# EAGLE board Olympus v1 (EAGLE 7.2.0)
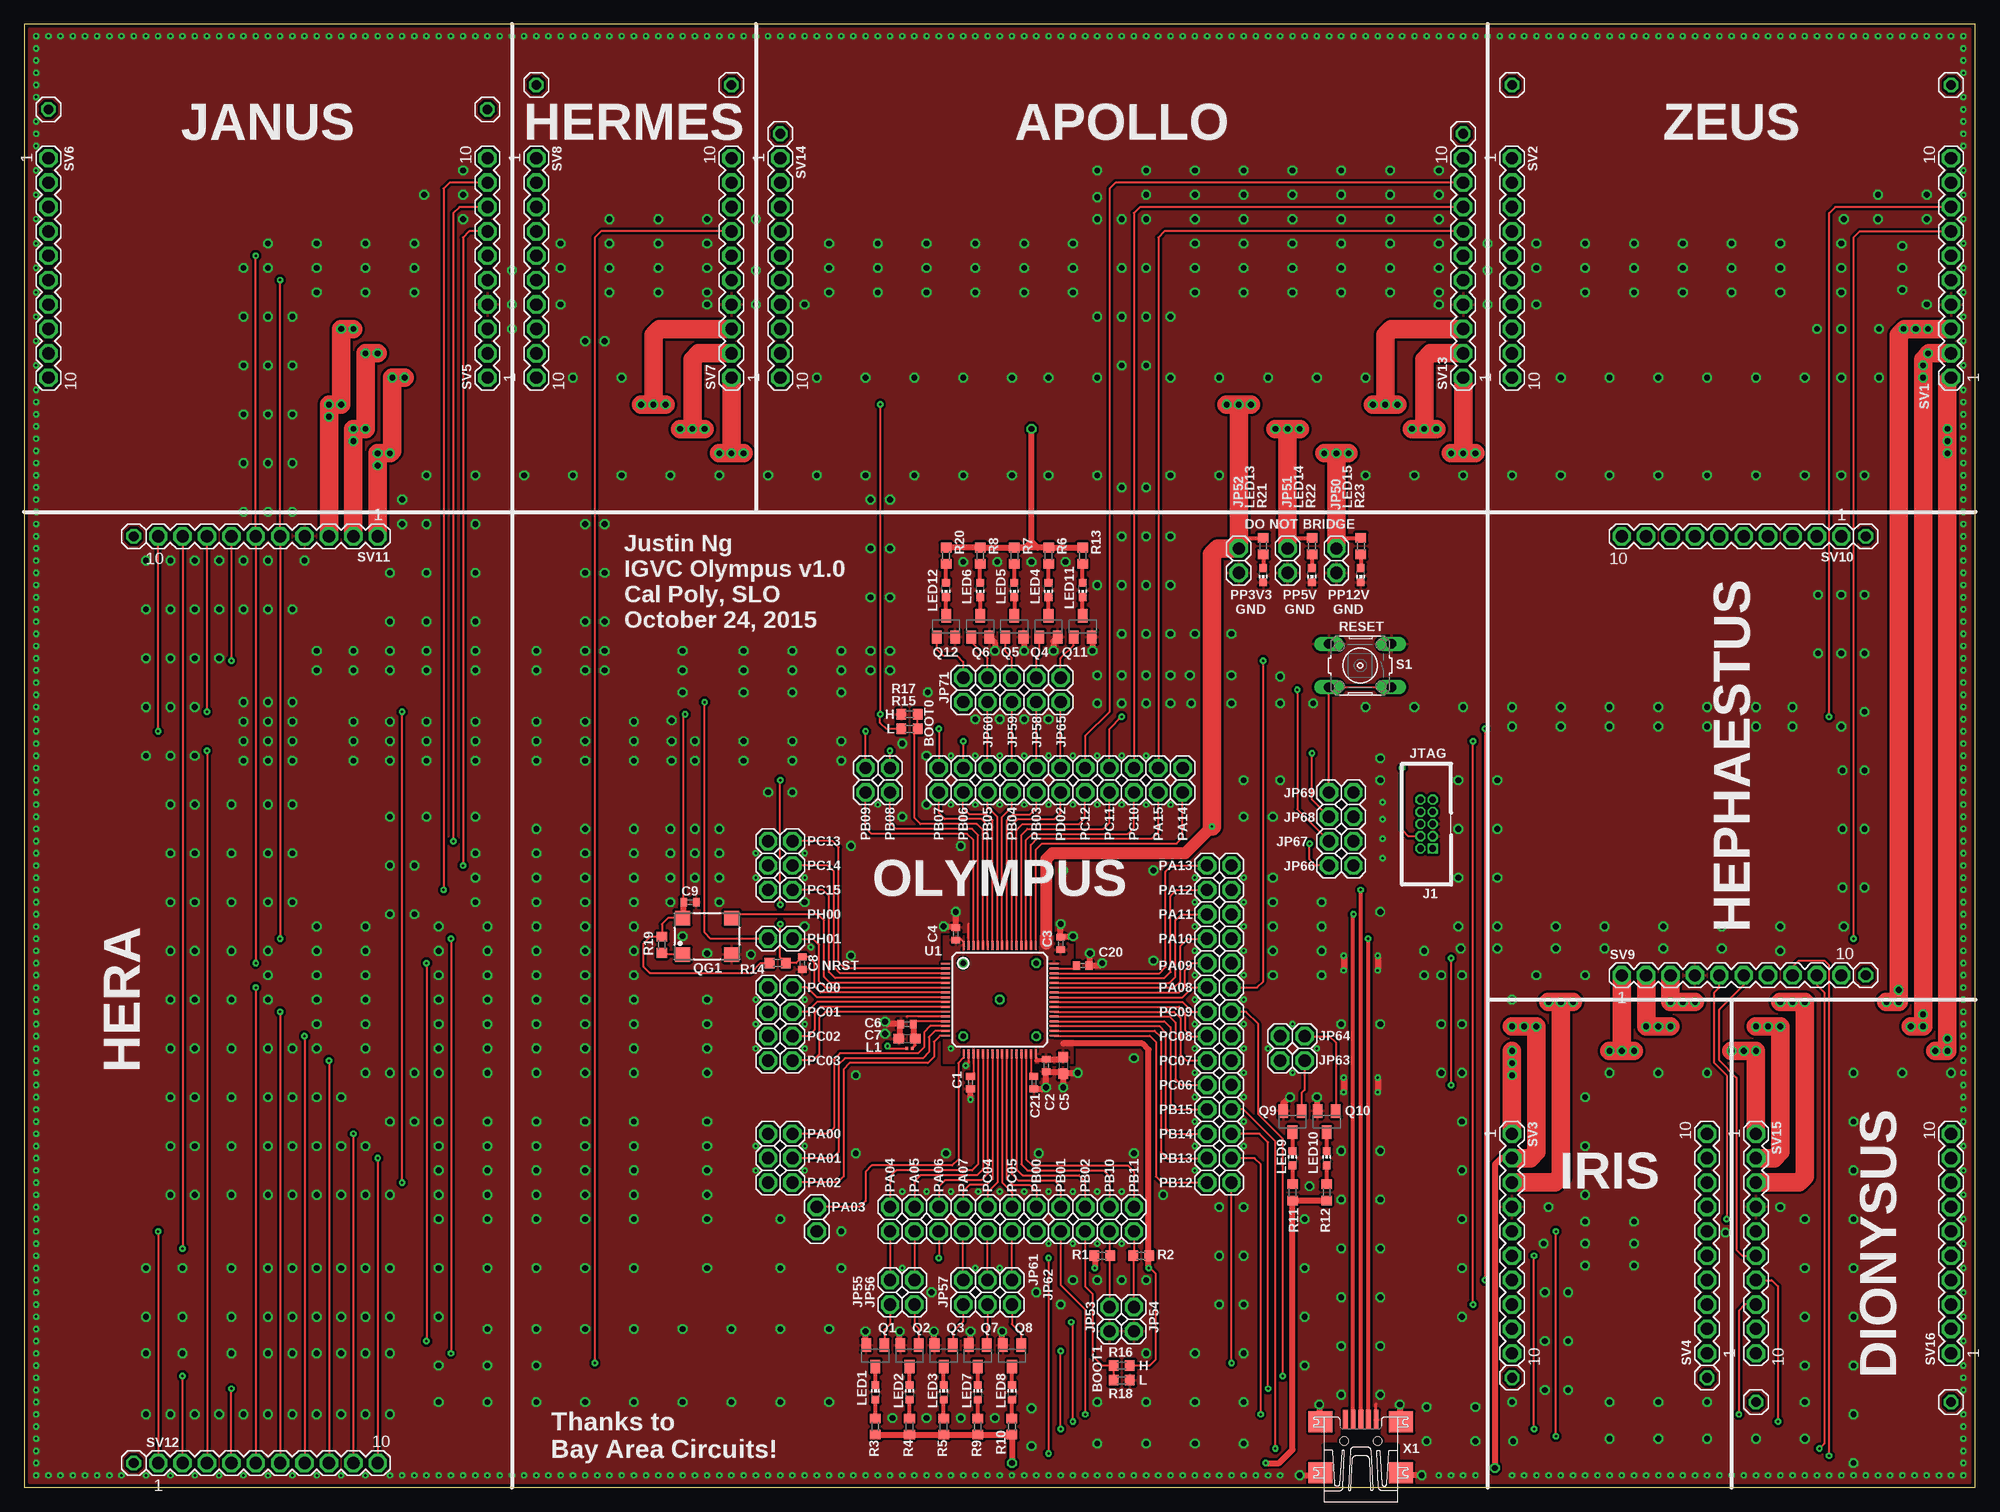
[diagram p2: board, top side]
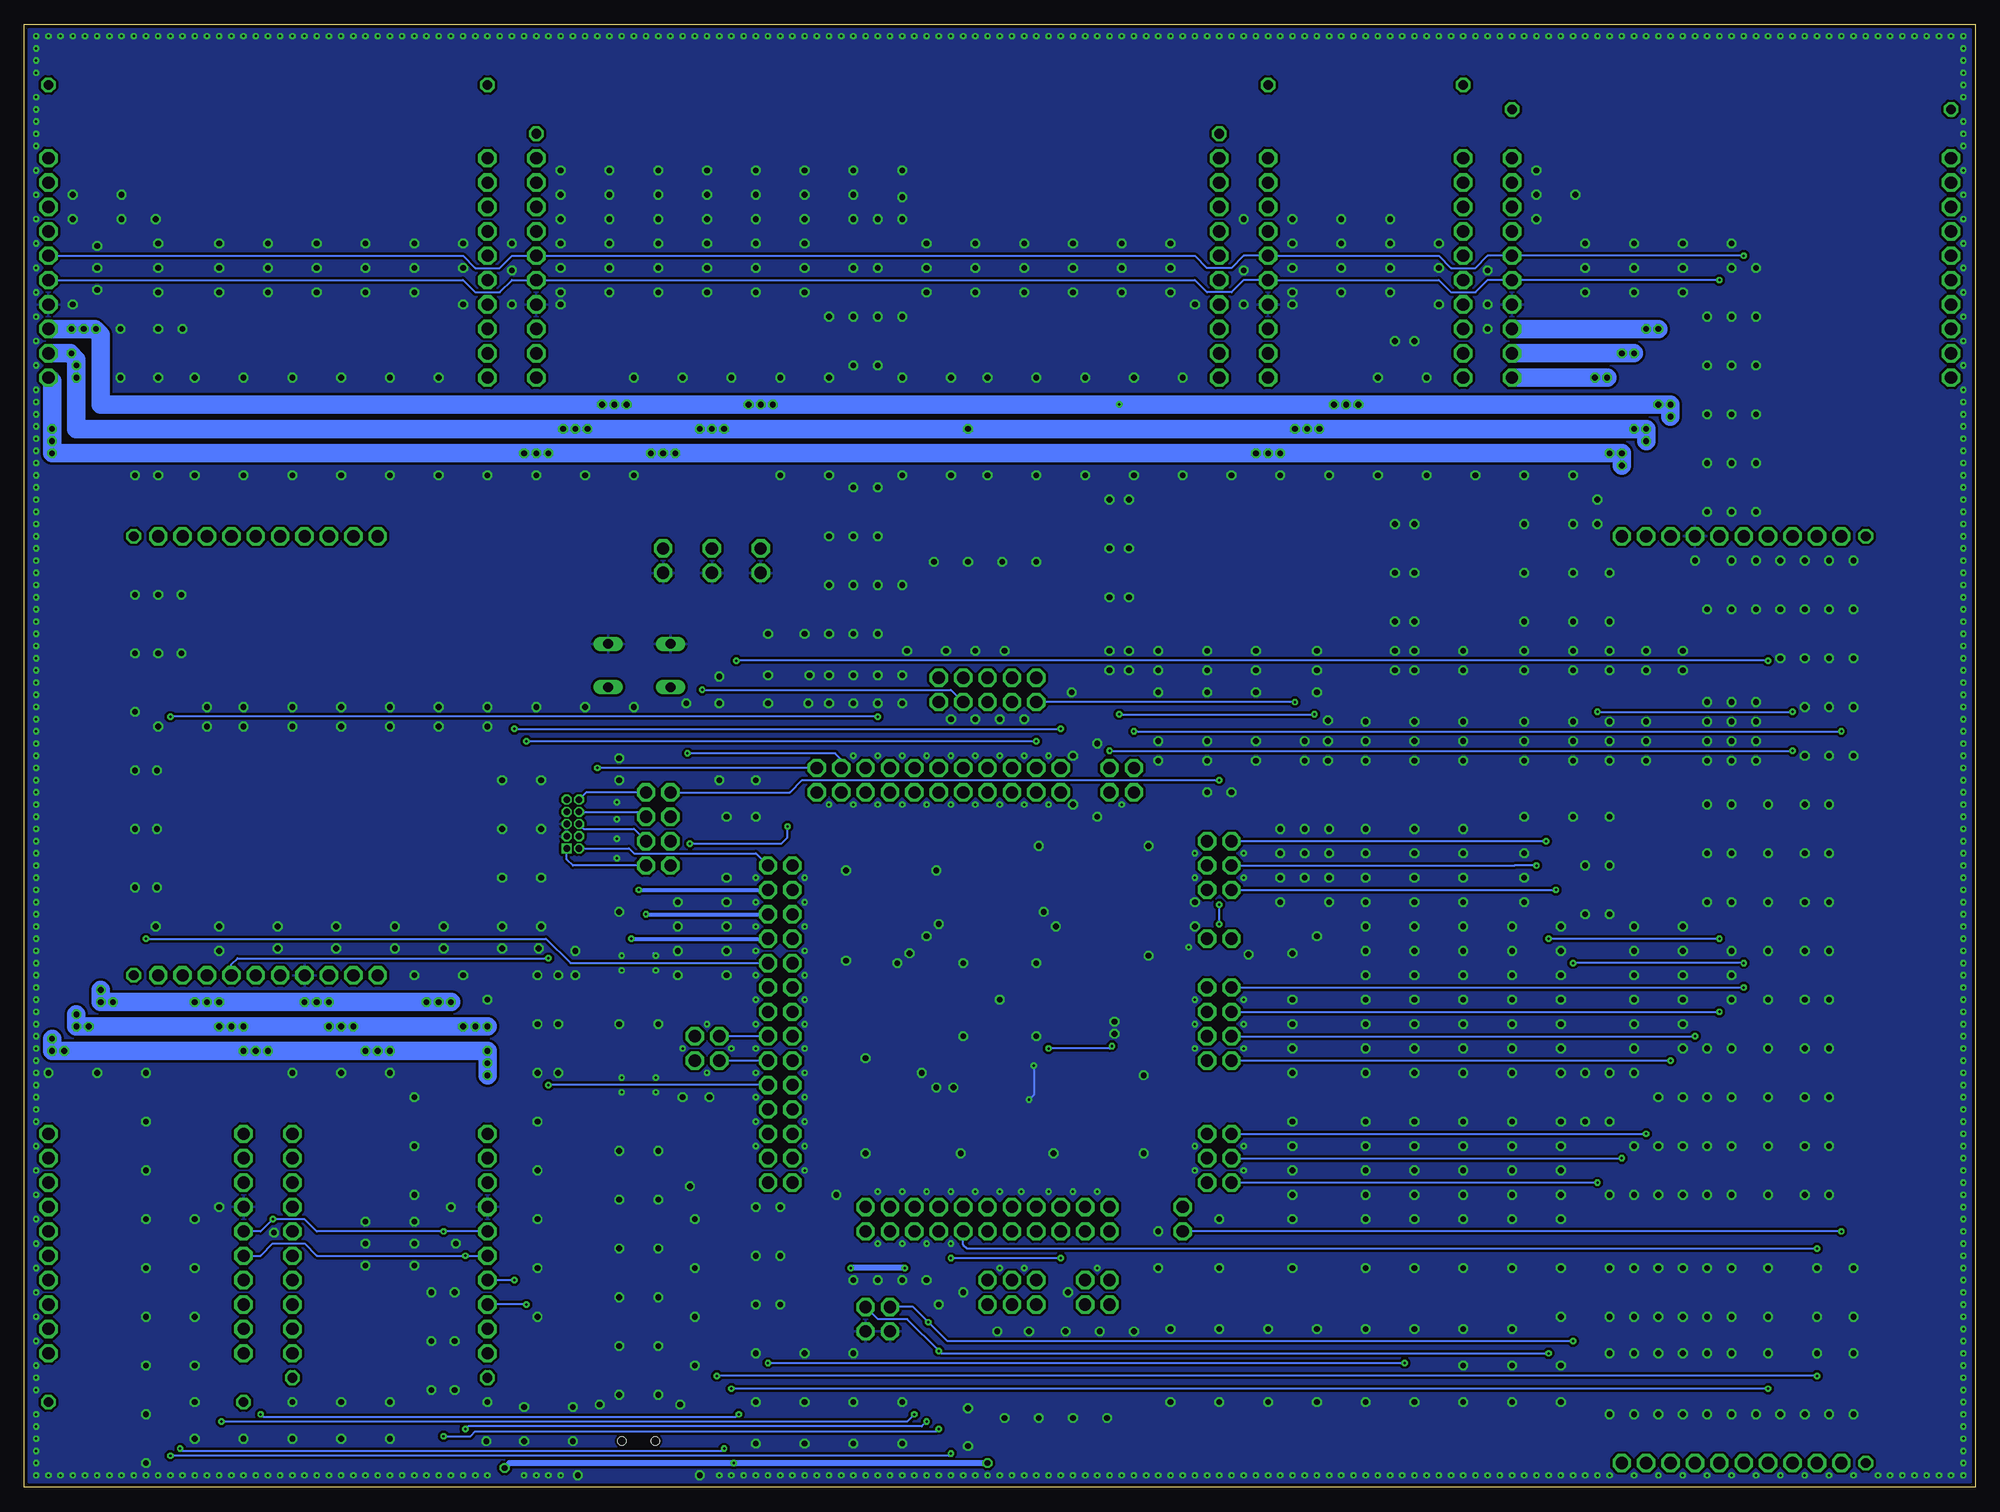
[diagram p3: board, bottom side, seen from below]

Size 203.2 x 152.4 mm. Coordinates in mm from the lower left corner, seen from the top.
Outline: 0,0 203.2,0 203.2,152.4 0,152.4 0,0
Copper layers (1*16): Top 0.035mm / dielectric 1.5mm / Bottom 0.035mm
Design rules "default *": minimum track width 7mil, minimum drill 10mil, track to track 8mil, track to pad 8mil, pad to pad 8mil, via to via 8mil, smd to smd 8mil, copper to edge 10mil, drill to drill 8mil, minimum pad ring 0mil, minimum via ring 8mil, stop-mask expansion 4mil, vias tented up to drill 0mil, thermal gap 10mil

## Footprints (pad centres in the part's own frame; a part is rotated, then mirrored left to right if it is on the bottom)
C0402 = smd 0.7 x 0.9: 1 -0.65,0; 2 0.65,0
C0603 = smd 1.1 x 1: 1 -0.85,0; 2 0.85,0
HEADER_10P_0.05 = drill 0.7 pad 1.016 square: 1 -2.54,-0.635 | drill 0.7 pad 1.016 octagon: 2 -2.54,0.635; 3 -1.27,-0.635; 4 -1.27,0.635; 5 0,-0.635; 6 0,0.635; 7 1.27,-0.635; 8 1.27,0.635; 9 2.54,-0.635; 10 2.54,0.635
1X02 = drill 1.27 octagon: 1 -1.27,0; 2 1.27,0
1X01 = drill 1.016 octagon: 1 0,0
L0201 = smd 0.25 x 0.35: 1 -0.275,0; 2 0.275,0
CHIP-LED0603 = smd 0.8 x 0.8: A 0,-0.75; C 0,0.75
SOT23 = smd 1 x 1.4: 1 -0.95,-1.1; 2 0.95,-1.1; 3 0,1.1
SM77H = smd 1.6 x 1.5: 1 -2.55,-1.9; 2 2.55,-1.9; 3 2.55,1.9; 4 -2.55,1.9
R0603 = smd 1 x 1.1: 1 -0.85,0; 2 0.85,0
B3F-10XX = drill 1.016 long: 1 -3.251,2.261; 2 3.251,2.261; 3 -3.251,-2.261; 4 3.251,-2.261
MA10-1 = drill 1.27 octagon: 1 -11.43,0; 2 -8.89,0; 3 -6.35,0; 4 -3.81,0; 5 -1.27,0; 6 1.27,0; 7 3.81,0; 8 6.35,0; 9 8.89,0; 10 11.43,0
LQFP-ST-64-2 = smd 0.9 x 0.2: 1 -5.65,3.75; 2 -5.65,3.25; 3 -5.65,2.75; 4 -5.65,2.25; 5 -5.65,1.75; 6 -5.65,1.25; 7 -5.65,0.75; 8 -5.65,0.25; 9 -5.65,-0.25; 10 -5.65,-0.75; 11 -5.65,-1.25; 12 -5.65,-1.75; 13 -5.65,-2.25; 14 -5.65,-2.75; 15 -5.65,-3.25; 16 -5.65,-3.75; 33 5.65,-3.75; 34 5.65,-3.25; 35 5.65,-2.75; 36 5.65,-2.25; 37 5.65,-1.75; 38 5.65,-1.25; 39 5.65,-0.75; 40 5.65,-0.25; 41 5.65,0.25; 42 5.65,0.75; 43 5.65,1.25; 44 5.65,1.75; 45 5.65,2.25; 46 5.65,2.75; 47 5.65,3.25; 48 5.65,3.75 | smd 0.2 x 0.9: 17 -3.75,-5.65; 18 -3.25,-5.65; 19 -2.75,-5.65; 20 -2.25,-5.65; 21 -1.75,-5.65; 22 -1.25,-5.65; 23 -0.75,-5.65; 24 -0.25,-5.65; 25 0.25,-5.65; 26 0.75,-5.65; 27 1.25,-5.65; 28 1.75,-5.65; 29 2.25,-5.65; 30 2.75,-5.65; 31 3.25,-5.65; 32 3.75,-5.65; 49 3.75,5.65; 50 3.25,5.65; 51 2.75,5.65; 52 2.25,5.65; 53 1.75,5.65; 54 1.25,5.65; 55 0.75,5.65; 56 0.25,5.65; 57 -0.25,5.65; 58 -0.75,5.65; 59 -1.25,5.65; 60 -1.75,5.65; 61 -2.25,5.65; 62 -2.75,5.65; 63 -3.25,5.65; 64 -3.75,5.65
UX60-MB-5ST = smd 2 x 0.5: 1 2.25,1.6; 2 2.25,0.8; 3 2.25,0; 4 2.25,-0.8; 5 2.25,-1.6 | smd 2.2 x 2.5: M1 -3.3,-4.2; M2 -3.3,4.2; M3 2,4.2; M4 2,-4.2 | hole 0.9: 0,-1.75; 0,1.75

## Placement (x,y rotation side)
C1  0.1uF  [C0402]  98.55,42.16 270 top
C2  0.1uF  [C0402]  106.43,43.94 270 top
C3  0.1uF  [C0402]  107.95,56.64 90 top
C4  0.1uF  [C0402]  97.03,57.66 90 top
C5  4.7uF  [C0603]  108.2,43.94 270 top
C6  0.1uF  [C0402]  91.95,48.26 180 top
C7  1uF  [C0603]  91.95,46.74 180 top
C8  0.1uF  [C0402]  81.03,54.61 270 top
C9  0.1uF  [C0402]  69.34,60.96 0 top
C20  2.2uF  [C0402]  110.24,54.36 0 top
C21  2.2uF  [C0402]  105.16,42.16 270 top
J1  HEADER_10P_0.05  [HEADER_10P_0.05]  146.05,69.09 90 top
JP1  [1X02]  78.74,36.83 0 top
JP2  [1X02]  78.74,34.29 0 top
JP3  [1X02]  78.74,31.75 0 top
JP4  [1X02]  82.55,27.94 90 top
JP5  [1X02]  90.17,27.94 90 top
JP6  [1X02]  92.71,27.94 90 top
JP7  [1X02]  95.25,27.94 90 top
JP8  [1X02]  97.79,27.94 90 top
JP9  [1X02]  124.46,52.07 180 top
JP10  [1X02]  124.46,54.61 180 top
JP11  [1X02]  124.46,57.15 180 top
JP12  [1X02]  124.46,59.69 180 top
JP13  [1X02]  124.46,62.23 180 top
JP14  [1X02]  124.46,64.77 180 top
JP15  [1X02]  120.65,73.66 270 top
JP16  [1X02]  118.11,73.66 270 top
JP17  [1X02]  105.41,27.94 90 top
JP18  [1X02]  107.95,27.94 90 top
JP19  [1X02]  110.49,27.94 90 top
JP20  [1X02]  105.41,73.66 270 top
JP21  [1X02]  102.87,73.66 270 top
JP22  [1X02]  100.33,73.66 270 top
JP23  [1X02]  97.79,73.66 270 top
JP24  [1X02]  95.25,73.66 270 top
JP25  [1X02]  90.17,73.66 270 top
JP26  [1X02]  87.63,73.66 270 top
JP27  [1X02]  113.03,27.94 90 top
JP28  [1X02]  115.57,27.94 90 top
JP29  [1X02]  124.46,31.75 180 top
JP30  [1X02]  124.46,34.29 180 top
JP31  [1X02]  124.46,36.83 180 top
JP32  [1X02]  124.46,39.37 180 top
JP33  [1X02]  78.74,52.07 180 top
JP34  [1X02]  78.74,49.53 180 top
JP35  [1X02]  78.74,46.99 180 top
JP36  [1X02]  78.74,44.45 180 top
JP37  [1X02]  100.33,27.94 270 top
JP38  [1X02]  102.87,27.94 270 top
JP39  [1X02]  124.46,41.91 0 top
JP40  [1X02]  124.46,44.45 0 top
JP41  [1X02]  124.46,46.99 0 top
JP42  [1X02]  124.46,49.53 0 top
JP43  [1X02]  115.57,73.66 90 top
JP44  [1X02]  113.03,73.66 90 top
JP45  [1X02]  110.49,73.66 90 top
JP46  [1X02]  78.74,67.31 180 top
JP47  [1X02]  78.74,64.77 180 top
JP48  [1X02]  78.74,62.23 180 top
JP49  [1X02]  107.95,73.66 90 top
JP50  [1X02]  136.65,96.52 270 top
JP51  [1X02]  131.57,96.52 270 top
JP52  [1X02]  126.49,96.52 270 top
JP53  [1X02]  113.03,17.53 270 top
JP54  [1X02]  115.57,17.53 270 top
JP55  [1X02]  90.17,20.32 90 top
JP56  [1X02]  92.71,20.32 90 top
JP57  [1X02]  97.79,20.32 90 top
JP58  [1X02]  105.41,83.06 270 top
JP59  [1X02]  102.87,83.06 270 top
JP60  [1X02]  100.33,83.06 270 top
JP61  [1X02]  100.33,20.32 90 top
JP62  [1X02]  102.87,20.32 90 top
JP63  [1X02]  132.08,44.45 180 top
JP64  [1X02]  132.08,46.99 180 top
JP65  [1X02]  107.95,83.06 270 top
JP66  [1X02]  137.16,64.77 0 top
JP67  [1X02]  137.16,67.31 180 top
JP68  [1X02]  137.16,69.85 180 top
JP69  [1X02]  137.16,72.39 180 top
JP70  [1X02]  78.74,57.15 180 top
JP71  [1X02]  97.79,83.06 270 top
JP72  [1X01]  11.43,2.54 0 top
JP73  [1X01]  11.43,99.06 0 top
JP74  [1X01]  2.54,143.51 0 top
JP75  [1X01]  48.26,143.51 0 top
JP76  [1X01]  53.34,146.05 0 top
JP77  [1X01]  73.66,146.05 0 top
JP78  [1X01]  78.74,140.97 0 top
JP79  [1X01]  149.86,140.97 0 top
JP80  [1X01]  154.94,146.05 0 top
JP81  [1X01]  200.66,146.05 0 top
JP82  [1X01]  191.77,53.34 0 top
JP83  [1X01]  191.77,99.06 0 top
JP84  [1X01]  154.94,11.43 0 top
JP85  [1X01]  175.26,11.43 0 top
JP86  [1X01]  180.34,8.89 0 top
JP87  [1X01]  200.66,8.89 0 top
L1  [L0201]  92.2,45.72 180 top
LED1  [CHIP-LED0603]  88.65,9.91 0 top
LED2  [CHIP-LED0603]  92.2,9.91 0 top
LED3  [CHIP-LED0603]  95.76,9.91 0 top
LED4  [CHIP-LED0603]  106.68,93.47 180 top
LED5  [CHIP-LED0603]  103.12,93.47 180 top
LED6  [CHIP-LED0603]  99.57,93.47 180 top
LED7  [CHIP-LED0603]  99.31,9.91 0 top
LED8  [CHIP-LED0603]  102.87,9.91 0 top
LED9  [CHIP-LED0603]  132.08,34.29 0 top
LED10  [CHIP-LED0603]  135.64,34.29 0 top
LED11  [CHIP-LED0603]  110.24,93.47 180 top
LED12  [CHIP-LED0603]  96.01,93.47 180 top
LED13  [CHIP-LED0603]  129.03,95 180 top
LED14  [CHIP-LED0603]  134.11,95 180 top
LED15  [CHIP-LED0603]  139.19,95 180 top
Q1  BSS138  [SOT23]  88.65,13.72 180 top
Q2  BSS138  [SOT23]  92.2,13.72 180 top
Q3  BSS138  [SOT23]  95.76,13.72 180 top
Q4  BSS138  [SOT23]  106.68,89.66 0 top
Q5  BSS138  [SOT23]  103.12,89.66 0 top
Q6  BSS138  [SOT23]  99.57,89.66 0 top
Q7  BSS138  [SOT23]  99.31,13.72 180 top
Q8  BSS138  [SOT23]  102.87,13.72 180 top
Q9  BSS138  [SOT23]  132.08,38.1 180 top
Q10  BSS138  [SOT23]  135.64,38.1 180 top
Q11  BSS138  [SOT23]  110.24,89.66 0 top
Q12  BSS138  [SOT23]  96.01,89.66 0 top
QG1  KC7050A20.0000C3GE00  [SM77H]  71.12,57.4 0 top
R1  3.3k  [R0603]  112.27,24.13 180 top
R2  3.3k  [R0603]  116.33,24.13 0 top
R3  100  [R0603]  88.65,6.35 270 top
R4  100  [R0603]  92.2,6.35 270 top
R5  100  [R0603]  95.76,6.35 270 top
R6  100  [R0603]  106.68,97.03 90 top
R7  100  [R0603]  103.12,97.03 90 top
R8  100  [R0603]  99.57,97.03 90 top
R9  100  [R0603]  99.31,6.35 270 top
R10  100  [R0603]  102.87,6.35 270 top
R11  100  [R0603]  132.08,30.73 270 top
R12  100  [R0603]  135.64,30.73 270 top
R13  100  [R0603]  110.24,97.03 90 top
R14  10k  [R0603]  78.49,54.61 180 top
R15  10k  [R0603]  92.2,78.99 180 top
R16  10k  [R0603]  114.3,12.7 0 top
R17  10k  [R0603]  92.2,80.52 0 top
R18  10k  [R0603]  114.3,11.18 180 top
R19  10k  [R0603]  66.42,56.52 90 top
R20  100  [R0603]  96.01,97.03 90 top
R21  100  [R0603]  129.03,98.04 90 top
R22  100  [R0603]  134.11,98.04 90 top
R23  100  [R0603]  139.19,98.04 90 top
S1  [B3F-10XX]  139.13,85.6 180 top
SV1  [MA10-1]  200.66,127 90 top
SV2  [MA10-1]  154.94,127 270 top
SV3  [MA10-1]  154.94,25.4 270 top
SV4  [MA10-1]  175.26,25.4 90 top
SV5  [MA10-1]  48.26,127 90 top
SV6  [MA10-1]  2.54,127 270 top
SV7  [MA10-1]  73.66,127 90 top
SV8  [MA10-1]  53.34,127 270 top
SV9  [MA10-1]  177.8,53.34 0 top
SV10  [MA10-1]  177.8,99.06 180 top
SV11  [MA10-1]  25.4,99.06 180 top
SV12  [MA10-1]  25.4,2.54 0 top
SV13  [MA10-1]  149.86,127 90 top
SV14  [MA10-1]  78.74,127 270 top
SV15  [MA10-1]  180.34,25.4 270 top
SV16  [MA10-1]  200.66,25.4 90 top
U1  STM32F205RGT6  [LQFP-ST-64-2]  101.6,50.8 0 top
X1  MINI-USB-UX60-MB-5ST  [UX60-MB-5ST]  139.19,4.83 90 top

## Tracks (layer width: path | path; a pad name or v marks a point on that pad's centre or on a via)
APOLLO_SPI_MOSI
  Top 0.203: SV13.9 113.67,135.89 113.03,135.25 113.03,80.77 110.49,78.23 JP45.2
APOLLO_SPI_SCK
  Top 0.203: SV13.8 116.2,133.35 115.57,132.72 JP43.2
APOLLO_SPI_SS_N  (via drill 0.25)
  Top 0.203: SV13.7 118.75,130.81 118.11,130.18 JP16.1 | JP68.2 134.11,71.63 v134.11,76.45
  Bottom 0.203: JP16.1 118.11,75.82 118.75,76.45 v134.11,76.45
DIONYSUS_BRD_EN  (via drill 0.25)
  Top 0.203: SV15.7 181.99,21.59 182.63,20.95 v182.63,6.86 | JP18.1 107.95,21.08 110.49,18.54 v110.49,7.62
  Bottom 0.203: v110.49,7.62 111.25,6.86 v182.63,6.86
DIONYSUS_GPIO  (via drill 0.25)
  Top 0.203: SV15.8 179.2,19.05 178.56,18.41 v178.56,7.62 | v128.78,7.62 128.78,33.66 128.14,34.29 JP30.1
  Bottom 0.203: v178.56,7.62 178.31,7.37 129.03,7.37 v128.78,7.62
GND  (via drill 0.25, 0.6)
  Top 0.203: U1.18 98.35,44.25 v98.04,43.94 | 98.3,41.26 C1.2 | U1.63 98.35,58.69 | U1.12 91.93,49.05 | 91.3,48.41 C6.2
  Top 0.305: X1.5 140.79,8.71
  Top 0.61: v98.55,40.39 C1.2 | 91.3,46.94 C7.2 91.19,46.74 91.19,48.26 | C21.2 106.28,41.51 106.28,41.66 v106.43,41.66 106.43,43.18 | C5.2 108.29,43.18 v109.73,43.18 | C2.2 108.2,43.29 C5.2 | C5.2 v108.2,41.66 | C6.2 91.19,48.26 | C4.2 97.03,58.42 | 97.03,58.42 v97.03,59.94 | 107.95,57.4 v109.22,57.4 | C3.2 v107.95,58.67 | 111,54.47 v111,55.63 | C20.2 112.01,54.36 v112.27,54.61 | Q6.2 101.09,87.99 v101.09,87.12 | Q5.2 104.14,88.5 v104.14,87.12 | Q4.2 107.19,88.12 v107.19,87.12 | Q11.2 111.25,88.5 v111.25,87.12 | Q9.2 131.13,40.01 131.76,40.64 v131.83,40.64 | Q10.2 134.69,40.57 v134.62,40.64 | Q1.2 87.63,14.88 v87.63,16.26 | Q2.2 91.19,14.88 v91.19,16.26 | Q3.2 94.74,14.88 v94.74,16.26 | Q7.2 98.55,15 v98.55,16.26 | Q8.2 101.85,14.88 v101.85,16.26 | v134.87,8.64 134.87,7.11 | v143.26,8.64 143.26,7.11 | v145.54,1.27 143.26,1.27 | v132.84,1.27 134.87,1.27 | v137.41,55.37 v137.41,53.85 | v140.97,55.37 v140.97,53.85 | v137.41,42.67 v137.41,41.15 | v140.97,42.67 v140.97,41.15 | v95.76,58.42 97.03,58.42 | 91.19,48.26 89.92,48.26 arc-90 v89.66,48.51
  Bottom 0.203: v98.04,43.94 98.04,40.89 v98.55,40.39 | 137.67,55.63 v137.41,55.37
  other vias: 89.66,47.24 141.22,9.65 147.32,134.62 147.32,132.08 137.16,134.62 137.16,132.08 127,134.62 127,132.08 116.84,134.62 116.84,132.08 116.84,121.92 114.3,121.92 116.84,104.14 114.3,104.14 116.84,116.84 114.3,116.84 114.3,132.08 160.02,115.57 142.24,134.62 142.24,132.08 132.08,134.62 132.08,132.08 121.92,134.62 121.92,132.08 114.3,127 116.84,127 121.92,127 127,127 132.08,127 137.16,127 142.24,127 109.22,127 104.14,127 99.06,127 93.98,127 88.9,127 83.82,127 71.12,127 66.04,127 60.96,127 55.88,127 40.64,127 35.56,127 30.48,127 157.48,127 162.56,127 167.64,127 172.72,127 177.8,127 182.88,127 195.58,127 165.1,115.57 170.18,115.57 175.26,115.57 180.34,115.57 185.42,115.57 160.02,105.41 165.1,105.41 170.18,105.41 175.26,105.41 180.34,105.41 185.42,105.41 154.94,105.41 149.86,105.41 144.78,105.41 139.7,105.41 124.46,105.41 119.38,105.41 111.76,105.41 106.68,105.41 102.87,105.41 97.79,105.41 92.71,105.41 87.63,105.41 82.55,105.41 77.47,105.41 72.39,105.41 67.31,105.41 62.23,105.41 57.15,105.41 52.07,105.41 46.99,105.41 41.91,105.41 57.15,115.57 62.23,115.57 82.55,115.57 87.63,115.57 92.71,115.57 97.79,115.57 102.87,115.57 106.68,115.57 111.76,115.57 119.38,115.57 124.46,115.57 129.54,115.57 134.62,115.57 139.7,115.57 147.32,123.19 152.4,123.19 157.48,123.19 198.12,123.19 81.28,123.19 71.12,123.19 50.8,123.19 55.88,123.19 50.8,120.65 111.76,121.92 119.38,121.92 182.88,129.54 182.88,124.46 177.8,124.46 177.8,129.54 172.72,129.54 172.72,124.46 167.64,124.46 167.64,129.54 162.56,129.54 162.56,124.46 157.48,129.54 142.24,129.54 137.16,129.54 142.24,124.46 137.16,124.46 132.08,124.46 132.08,129.54 127,129.54 121.92,129.54 121.92,124.46 127,124.46 109.22,129.54 109.22,124.46 104.14,124.46 104.14,129.54 99.06,129.54 99.06,124.46 93.98,129.54 88.9,129.54 83.82,129.54 83.82,124.46 88.9,124.46 93.98,124.46 71.12,129.54 71.12,124.46 66.04,124.46 66.04,129.54 60.96,129.54 55.88,129.54 60.96,124.46 40.64,129.54 40.64,124.46 35.56,124.46 35.56,129.54 30.48,129.54 30.48,124.46 25.4,129.54 25.4,127 25.4,121.92 25.4,116.84 25.4,111.76 25.4,106.68 27.94,121.92 27.94,116.84 27.94,111.76 27.94,106.68 22.86,106.68 22.86,111.76 22.86,116.84 22.86,121.92 22.86,127 39.37,102.87 39.37,100.33 29.21,96.52 198.12,132.08 193.04,132.08 45.72,134.62 45.72,132.08 167.64,25.4 162.56,25.4 200.66,43.18 195.58,43.18 190.5,43.18 175.26,43.18 170.18,43.18 165.1,43.18 162.56,53.34 157.48,53.34 154.94,50.8 162.56,40.64 162.56,35.56 162.56,30.48 158.75,29.21 182.88,29.21 182.88,55.88 190.5,38.1 190.5,33.02 190.5,27.94 190.5,22.86 190.5,17.78 190.5,12.7 190.5,7.62 190.5,2.54 165.1,5.08 170.18,5.08 175.26,5.08 180.34,5.08 185.42,5.08 185.42,12.7 185.42,17.78 185.42,22.86 185.42,27.94 175.26,8.89 170.18,8.89 165.1,8.89 185.42,8.89 154.94,8.89 15.24,96.52 17.78,96.52 25.4,96.52 15.24,91.44 17.78,91.44 15.24,86.36 12.7,96.52 12.7,91.44 12.7,86.36 17.78,86.36 17.78,81.28 12.7,81.28 15.24,81.28 15.24,76.2 12.7,76.2 17.78,76.2 15.24,71.12 17.78,71.12 17.78,66.04 15.24,66.04 15.24,60.96 17.78,60.96 17.78,55.88 15.24,55.88 15.24,50.8 17.78,50.8 17.78,45.72 15.24,45.72 15.24,40.64 17.78,40.64 17.78,35.56 15.24,35.56 15.24,30.48 17.78,30.48 12.7,22.86 12.7,17.78 16.51,17.78 21.59,17.78 21.59,22.86 16.51,22.86 12.7,13.97 12.7,7.62 25.4,91.44 22.86,91.44 22.86,96.52 27.94,91.44 27.94,79.76 25.4,79.76 22.86,79.76 21.59,71.12 21.59,66.04 21.59,60.96 21.59,55.88 21.59,50.8 21.59,45.72 21.59,40.64 21.59,35.56 21.59,30.48 25.4,71.12 25.4,66.04 25.4,60.96 27.94,60.96 27.94,66.04 27.94,71.12 30.48,58.42 35.56,58.42 30.48,55.88 35.56,55.88 30.48,53.34 35.56,53.34 30.48,50.8 35.56,50.8 30.48,48.26 35.56,48.26 30.48,45.72 35.56,45.72 35.56,43.18 30.48,40.64 27.94,40.64 25.4,40.64 25.4,45.72 27.94,45.72 25.4,50.8 25.4,53.34 25.4,55.88 25.4,35.56 25.4,30.48 27.94,30.48 27.94,35.56 30.48,35.56 30.48,30.48 33.02,35.56 33.02,40.64 33.02,30.48 35.56,30.48 35.56,35.56 25.4,22.86 27.94,22.86 30.48,22.86 33.02,22.86 35.56,22.86 25.4,17.78 27.94,17.78 30.48,17.78 33.02,17.78 35.56,17.78 38.1,22.86 38.1,17.78 38.1,30.48 38.1,7.62 38.1,13.97 35.56,13.97 33.02,13.97 30.48,13.97 27.94,13.97 25.4,13.97 21.59,13.97 16.51,13.97 15.24,7.62 17.78,7.62 20.32,7.62 22.86,7.62 25.4,7.62 27.94,7.62 30.48,7.62 33.02,7.62 35.56,7.62 43.18,12.7 43.18,8.89 48.26,8.89 43.18,22.86 48.26,22.86 43.18,27.94 48.26,27.94 43.18,35.56 48.26,35.56 43.18,33.02 48.26,33.02 48.26,30.48 43.18,30.48 43.18,38.1 48.26,38.1 43.18,43.18 48.26,43.18 43.18,45.72 48.26,45.72 48.26,48.26 43.18,48.26 43.18,50.8 48.26,50.8 48.26,53.34 43.18,53.34 43.18,55.88 48.26,55.88 48.26,58.42 43.18,58.42 38.1,95.25 38.1,90.17 38.1,85.09 38.1,79.76 38.1,75.69 38.1,69.85 38.1,64.77 40.64,64.77 38.1,59.69 40.64,59.69 41.91,100.33 46.99,100.33 46.99,95.25 46.99,90.17 46.99,85.09 46.99,79.76 41.91,95.25 41.91,90.17 41.91,85.09 41.91,79.76 41.91,75.69 41.91,69.85 46.99,75.69 46.99,69.85 46.99,66.04 46.99,63.5 46.99,60.96 53.34,55.88 58.42,55.88 63.5,55.88 53.34,53.34 58.42,53.34 63.5,53.34 63.5,50.8 58.42,50.8 53.34,50.8 53.34,48.26 58.42,48.26 63.5,48.26 63.5,45.72 58.42,45.72 53.34,45.72 53.34,43.18 58.42,43.18 63.5,43.18 63.5,58.42 58.42,58.42 53.34,58.42 71.12,50.8 71.12,48.26 71.12,45.72 71.12,43.18 53.34,38.1 58.42,38.1 63.5,38.1 71.12,38.1 71.12,35.56 71.12,33.02 63.5,33.02 63.5,35.56 58.42,35.56 53.34,35.56 53.34,33.02 53.34,30.48 58.42,30.48 58.42,33.02 63.5,30.48 71.12,30.48 53.34,27.94 58.42,27.94 63.5,27.94 71.12,27.94 71.12,22.86 63.5,22.86 58.42,22.86 53.34,22.86 68.58,16.51 63.5,16.51 78.74,22.86 73.66,16.51 53.34,8.89 58.42,8.89 63.5,8.89 68.58,8.89 73.66,8.89 78.74,8.89 83.82,8.89 78.74,16.51 111.76,8.89 116.84,8.89 121.92,8.89 127,8.89 121.92,13.97 116.84,13.97 127,13.97 127,19.05 127,24.13 127,29.21 124.46,29.21 124.46,24.13 124.46,19.05 114.3,21.59 116.84,21.59 111.76,21.59 101.6,30.8 104.14,30.8 106.68,30.8 109.22,30.8 111.76,30.8 114.3,30.8 99.38,30.8 96.52,30.8 93.98,30.8 91.44,30.8 99.06,22.86 101.6,22.86 91.44,22.86 111.76,25.4 81.28,35.56 81.28,33.02 81.28,45.72 81.28,48.26 81.28,50.8 81.28,63.5 81.28,66.04 88.9,71.12 96.52,71.12 99.06,71.12 101.6,71.12 104.14,71.12 106.68,71.12 109.22,71.12 101.6,76.2 104.14,76.2 106.68,76.2 111.76,71.12 114.3,71.12 116.84,71.12 119.38,71.12 121.92,63.5 121.92,60.96 121.92,58.42 121.92,55.88 121.92,53.34 121.92,50.8 121.92,48.26 121.92,45.72 121.92,43.18 121.92,40.64 121.92,38.1 121.92,35.56 121.92,33.02 127,35.56 127,38.1 127,40.64 127,43.18 127,45.72 127,48.26 127,63.5 127,60.96 127,58.42 127,55.88 127,53.34 127,50.8 53.34,66.04 53.34,63.5 53.34,60.96 58.42,60.96 58.42,63.5 58.42,66.04 63.5,66.04 63.5,63.5 63.5,60.96 63.5,68.58 58.42,68.58 53.34,68.58 53.34,79.76 53.34,75.69 58.42,75.69 58.42,79.76 63.5,79.76 63.5,75.69 74.93,75.69 80.01,75.69 80.01,77.72 114.3,99.06 116.84,99.06 114.3,93.98 116.84,93.98 114.3,88.9 116.84,88.9 119.38,99.06 119.38,93.98 119.38,88.9 125.73,88.9 121.92,88.9 108.2,64.26 117.6,54.86 86.11,55.37 97.54,66.8 115.57,44.7 105.66,34.8 86.61,42.93 96.01,34.8 101.6,50.8 105.41,54.61 97.79,46.99 105.41,46.99 97.79,54.61 147.32,137.16 142.24,137.16 137.16,137.16 132.08,137.16 127,137.16 121.92,137.16 116.84,137.16 111.76,137.16 111.76,134.37 111.76,132.08 45.72,137.16 41.66,134.62 76.2,132.08 152.4,129.54 152.4,126.75 195.58,129.29 195.58,124.71 198.12,134.62 193.04,134.62 189.48,132.08 189.23,115.57 193.17,115.57 189.23,120.65 193.17,120.65 189.23,105.41 191.64,92.96 191.64,86.87 191.64,74.68 191.64,68.58 191.64,62.48 182.88,58.42 189.48,58.42 176.78,58.42 170.69,58.42 164.59,58.42 159.51,58.42 153.42,58.42 149.35,58.42 145.8,55.88 145.8,53.34 111.76,4.57 116.84,4.57 121.92,4.57 127,4.57 137.16,9.65 137.16,14.73 141.22,14.73 137.16,19.81 141.22,19.81 137.16,24.89 141.22,24.89 141.22,29.97 137.16,29.97 137.16,35.05 141.22,35.05 141.22,48.26 137.16,48.26 130.05,60.96 130.05,58.42 130.05,55.88 130.05,53.34 130.05,63.5 135.13,55.88 135.13,53.34 135.13,58.42 135.13,60.96 141.22,59.94 149.35,63.5 153.42,63.5 149.35,68.58 153.42,68.58 149.35,73.66 153.42,73.66 111.76,93.98 141.22,75.95 141.48,71.37 141.48,69.6 141.48,67.56 141.48,65.53 71.12,55.63 53.34,77.72 58.42,77.72 63.5,77.72 69.85,75.69 69.85,77.72 74.93,77.72 85.09,77.72 85.09,75.69 74.93,82.8 80.01,82.8 85.09,82.8 94.11,82.8 101.6,80.01 104.14,80.01 106.68,80.01 99.06,80.01 91.44,77.47 91.44,69.85 93.98,71.12 93.98,76.2 69.85,68.58 72.39,68.58 67.31,68.58 67.44,75.69 67.31,66.04 69.85,66.04 72.39,66.04 72.39,63.5 69.85,63.5 67.31,63.5 67.31,60.96 72.39,60.96 75.69,55.5 68.58,57.4 81.28,60.96 81.28,58.42 81.92,56.26 40.64,43.18 40.64,38.1 38.1,38.1 38.1,43.18 43.18,17.78 48.26,12.7 53.34,12.7 83.82,16.51 58.42,16.51 53.34,16.51 48.26,16.51 78.74,27.94 85.09,26.67 85.09,22.86 94.49,20.32 105.41,20.32 109.22,21.59 132.08,43.18 132.08,48.26 134.62,45.72 129.54,45.72 116.84,76.2 114.3,76.2 111.76,76.2 109.22,76.2 99.06,76.2 96.52,76.2 76.2,66.04 76.2,63.5 76.2,50.8 76.2,48.26 76.2,45.72 76.2,35.56 76.2,33.02 106.68,25.4 109.22,25.4 114.3,25.4 34.29,79.76 34.29,75.69 34.29,77.72 38.1,77.72 41.91,77.72 46.99,77.72 25.4,77.72 27.94,77.72 22.86,77.72 22.86,75.69 25.4,75.69 27.94,75.69 130.81,73.66 127,73.66 141.22,73.66 184.15,81.28 180.34,81.28 175.26,81.28 170.18,81.28 165.1,81.28 160.02,81.28 154.94,81.28 149.86,81.28 144.78,81.28 139.7,81.28 154.94,79.25 160.02,79.25 165.1,79.25 170.18,79.25 175.26,79.25 180.34,79.25 184.15,79.25 189.23,79.25 176.78,56.13 170.69,56.13 164.59,56.13 159.51,56.13 153.42,56.13 149.61,56.13 149.73,53.34 149.73,48.26 149.73,43.18 147.57,48.26 147.57,43.18 147.57,53.34 149.73,38.1 149.73,33.02 149.73,27.94 149.73,22.86 149.73,17.78 158.24,25.4 158.37,20.32 158.37,15.24 158.37,10.16 155.07,4.83 151.13,4.83 146.05,4.83 90.42,7.24 93.98,7.24 97.54,7.24 101.09,7.24 133.86,31.37 133.35,27.94 133.35,22.86 133.35,17.78 133.35,12.7 130.05,69.85 127,69.85 119.38,81.66 121.54,81.66 116.84,81.66 114.3,81.66 111.76,81.66 125.73,81.66 130.81,81.66 134.24,81.66 130.81,84.45 97.79,96.39 101.35,96.39 104.9,96.39 108.46,96.39 68.58,82.8 67.44,79.88 67.44,77.72 80.01,72.39 77.47,72.39 58.42,85.09 60.45,85.09 58.42,90.17 60.45,90.17 60.45,95.25 58.42,95.25 58.42,100.33 60.45,100.33 60.45,119.38 58.42,119.38 88.14,102.87 88.14,97.79 90.17,97.79 88.14,92.71 90.17,92.71 90.17,102.87 88.14,87.12 90.17,87.12 118.62,30.48 115.57,34.8 86.61,34.8 86.11,66.8 117.6,64.26 191.64,80.77 191.64,105.41 189.23,127 189.23,92.96 186.82,92.96 189.23,86.87 186.82,86.87 189.36,74.68 189.36,68.58 189.36,62.48 107.95,19.05 104.9,8.26 104.9,4.32 22.86,81.79 25.4,81.79 27.94,81.79 167.64,27.69 167.64,23.11 162.56,27.69 162.56,23.11 160.78,20.32 160.78,15.24 160.78,10.16 146.05,8.38 151.13,8.38 34.29,85.09 34.29,87.12 38.1,87.12 41.91,87.12 46.99,87.12 30.48,85.09 30.48,87.12 53.34,85.09 53.34,87.12 58.42,87.12 60.45,87.12 68.58,85.09 68.58,87.12 74.93,85.09 74.93,87.12 80.01,85.09 80.01,87.12 85.09,87.12 85.09,85.09 90.17,85.09 88.14,85.09 114.3,84.58 116.84,84.58 119.38,84.58 121.41,84.58 111.76,84.58 125.73,84.58 189.23,124.46 189.23,129.54 147.32,129.54 147.32,127 147.32,124.46 76.2,126.75 76.2,123.19 71.12,132.08 66.04,132.08 60.96,132.08 50.8,126.75 25.4,101.6 22.86,101.6 27.94,101.6 20.32,96.52 20.32,91.44 20.32,86.36 10.16,1.27 8.89,1.27 7.62,1.27 6.35,1.27 5.08,1.27 3.81,1.27 2.54,1.27 1.27,1.27 1.27,2.54 1.27,3.81 1.27,5.08 1.27,6.35 1.27,7.62 1.27,8.89 1.27,10.16 1.27,11.43 1.27,12.7 1.27,13.97 1.27,15.24 1.27,16.51 1.27,17.78 1.27,19.05 1.27,20.32 1.27,21.59 1.27,22.86 1.27,24.13 1.27,25.4 1.27,26.67 1.27,29.21 1.27,27.94 1.27,30.48 1.27,31.75 1.27,33.02 1.27,34.29 1.27,35.56 1.27,36.83 1.27,38.1 1.27,39.37 1.27,40.64 1.27,41.91 1.27,43.18 1.27,44.45 1.27,45.72 1.27,46.99 1.27,48.26 1.27,49.53 1.27,50.8 1.27,52.07 1.27,53.34 1.27,54.61 1.27,55.88 1.27,57.15 1.27,58.42 1.27,59.69 1.27,60.96 1.27,62.23 1.27,63.5 1.27,64.77 1.27,66.04 1.27,67.31 1.27,68.58 1.27,69.85 1.27,71.12 1.27,72.39 1.27,73.66 1.27,74.93 1.27,76.2 1.27,77.47 1.27,78.74 1.27,80.01 1.27,81.28 1.27,82.55 1.27,83.82 1.27,85.09 1.27,86.36 1.27,87.63 1.27,88.9 1.27,90.17 1.27,91.44 1.27,92.71 1.27,93.98 1.27,95.25 1.27,96.52 1.27,97.79 1.27,99.06 1.27,100.33 1.27,101.6 1.27,102.87 1.27,104.14 1.27,105.41 1.27,106.68 1.27,107.95 1.27,109.22 1.27,110.49 1.27,111.76 1.27,113.03 1.27,114.3 1.27,116.84 1.27,119.38 1.27,121.92 1.27,124.46 1.27,127 1.27,129.54 1.27,132.08 1.27,134.62 1.27,137.16 1.27,139.7 1.27,140.97 1.27,142.24 1.27,144.78 1.27,146.05 1.27,147.32 1.27,148.59 1.27,149.86 1.27,151.13 2.54,151.13 5.08,151.13 3.81,151.13 6.35,151.13 7.62,151.13 8.89,151.13 10.16,151.13 11.43,151.13 12.7,151.13 13.97,151.13 15.24,151.13 16.51,151.13 17.78,151.13 19.05,151.13 20.32,151.13 21.59,151.13 22.86,151.13 24.13,151.13 25.4,151.13 26.67,151.13 27.94,151.13 29.21,151.13 30.48,151.13 31.75,151.13 33.02,151.13 34.29,151.13 35.56,151.13 36.83,151.13 38.1,151.13 39.37,151.13 40.64,151.13 43.18,151.13 41.91,151.13 44.45,151.13 45.72,151.13 46.99,151.13 48.26,151.13 50.8,151.13 49.53,151.13 52.07,151.13 53.34,151.13 54.61,151.13 55.88,151.13 57.15,151.13 58.42,151.13 59.69,151.13 60.96,151.13 62.23,151.13 63.5,151.13 64.77,151.13 66.04,151.13 67.31,151.13 68.58,151.13 69.85,151.13 72.39,151.13 71.12,151.13 73.66,151.13 76.2,151.13 74.93,151.13 77.47,151.13 80.01,151.13 78.74,151.13 81.28,151.13 83.82,151.13 82.55,151.13 85.09,151.13 86.36,151.13 87.63,151.13 88.9,151.13 90.17,151.13 91.44,151.13 93.98,151.13 92.71,151.13 95.25,151.13 96.52,151.13 97.79,151.13 99.06,151.13 100.33,151.13 101.6,151.13 102.87,151.13 104.14,151.13 105.41,151.13 106.68,151.13 107.95,151.13 110.49,151.13 109.22,151.13 111.76,151.13 113.03,151.13 115.57,151.13 114.3,151.13 116.84,151.13 118.11,151.13 119.38,151.13 120.65,151.13 123.19,151.13 121.92,151.13 124.46,151.13 125.73,151.13 127,151.13 128.27,151.13 129.54,151.13 132.08,151.13 130.81,151.13 133.35,151.13 134.62,151.13 137.16,151.13 135.89,151.13 138.43,151.13 139.7,151.13 140.97,151.13 142.24,151.13 143.51,151.13 144.78,151.13 146.05,151.13 147.32,151.13 148.59,151.13 149.86,151.13 151.13,151.13 152.4,151.13 153.67,151.13 154.94,151.13 156.21,151.13 157.48,151.13 158.75,151.13 160.02,151.13 162.56,151.13 161.29,151.13 163.83,151.13 165.1,151.13 166.37,151.13 167.64,151.13 168.91,151.13 170.18,151.13 171.45,151.13 172.72,151.13 173.99,151.13 175.26,151.13 176.53,151.13 177.8,151.13 179.07,151.13 180.34,151.13 181.61,151.13 182.88,151.13 184.15,151.13 185.42,151.13 187.96,151.13 186.69,151.13 189.23,151.13 190.5,151.13 191.77,151.13 193.04,151.13 194.31,151.13 196.85,151.13 195.58,151.13 198.12,151.13 200.66,151.13 199.39,151.13 201.93,151.13 201.93,149.86 201.93,148.59 201.93,147.32 201.93,144.78 201.93,143.51 201.93,142.24 201.93,140.97 201.93,139.7 201.93,137.16 201.93,134.62 201.93,132.08 201.93,129.54 201.93,127 201.93,124.46 201.93,121.92 201.93,119.38 201.93,116.84 201.93,44.45 201.93,43.18 201.93,41.91 201.93,39.37 201.93,40.64 201.93,38.1 201.93,35.56 201.93,33.02 201.93,30.48 201.93,27.94 201.93,25.4 201.93,22.86 201.93,20.32 201.93,17.78 201.93,15.24 201.93,12.7 201.93,11.43 201.93,10.16 201.93,7.62 201.93,6.35 201.93,5.08 201.93,3.81 201.93,2.54 201.93,1.27 200.66,1.27 199.39,1.27 198.12,1.27 196.85,1.27 195.58,1.27 194.31,1.27 193.04,1.27 191.77,1.27 190.5,1.27 189.23,1.27 187.96,1.27 186.69,1.27 185.42,1.27 184.15,1.27 182.88,1.27 181.61,1.27 180.34,1.27 179.07,1.27 177.8,1.27 176.53,1.27 175.26,1.27 173.99,1.27 172.72,1.27 171.45,1.27 170.18,1.27 168.91,1.27 167.64,1.27 166.37,1.27 165.1,1.27 163.83,1.27 162.56,1.27 161.29,1.27 160.02,1.27 158.75,1.27 157.48,1.27 156.21,1.27 154.94,1.27 151.13,1.27 149.86,1.27 148.59,1.27 147.32,1.27 130.81,1.27 129.54,1.27 128.27,1.27 127,1.27 124.46,1.27 125.73,1.27 123.19,1.27 120.65,1.27 121.92,1.27 119.38,1.27 116.84,1.27 118.11,1.27 115.57,1.27 114.3,1.27 113.03,1.27 111.76,1.27 110.49,1.27 109.22,1.27 107.95,1.27 106.68,1.27 105.41,1.27 104.14,1.27 102.87,1.27 101.6,1.27 100.33,1.27 97.79,1.27 99.06,1.27 96.52,1.27 93.98,1.27 95.25,1.27 92.71,1.27 91.44,1.27 90.17,1.27 88.9,1.27 87.63,1.27 86.36,1.27 85.09,1.27 83.82,1.27 82.55,1.27 81.28,1.27 80.01,1.27 78.74,1.27 77.47,1.27 76.2,1.27 74.93,1.27 73.66,1.27 72.39,1.27 71.12,1.27 69.85,1.27 68.58,1.27 66.04,1.27 67.31,1.27 64.77,1.27 63.5,1.27 62.23,1.27 60.96,1.27 59.69,1.27 58.42,1.27 57.15,1.27 55.88,1.27 54.61,1.27 53.34,1.27 52.07,1.27 50.8,1.27 49.53,1.27 48.26,1.27 46.99,1.27 45.72,1.27 44.45,1.27 43.18,1.27 41.91,1.27 40.64,1.27 39.37,1.27 38.1,1.27 35.56,1.27 33.02,1.27 30.48,1.27 27.94,1.27 25.4,1.27 22.86,1.27 20.32,1.27 17.78,1.27 15.24,1.27 12.7,1.27 201.93,45.72 201.93,46.99 201.93,48.26 201.93,49.53 201.93,50.8 201.93,52.07 201.93,53.34 201.93,54.61 201.93,55.88 201.93,57.15 201.93,58.42 201.93,59.69 201.93,62.23 201.93,60.96 201.93,63.5 201.93,64.77 201.93,66.04 201.93,67.31 201.93,68.58 201.93,69.85 201.93,71.12 201.93,72.39 201.93,73.66 201.93,74.93 201.93,76.2 201.93,77.47 201.93,78.74 201.93,80.01 201.93,81.28 201.93,82.55 201.93,83.82 201.93,85.09 201.93,86.36 201.93,87.63 201.93,88.9 201.93,90.17 201.93,91.44 201.93,92.71 201.93,93.98 201.93,95.25 201.93,96.52 201.93,97.79 201.93,99.06 201.93,100.33 201.93,101.6 201.93,102.87 201.93,104.14 201.93,105.41 201.93,106.68 201.93,107.95 201.93,109.22 201.93,110.49 201.93,111.76 201.93,113.03 201.93,114.3 186.69,120.65 177.16,26.54
  pour Bottom (isolate 0.254, rank 6): 0.51,151.89 0.51,0.51 202.69,0.51 202.69,151.89
  pour Top (isolate 0.254, rank 6): 0.51,151.89 0.51,0.51 202.69,0.51 202.69,151.89
HEPHAESTUS_DIR  (via drill 0.25)
  Top 0.203: v148.59,55.12 v148.59,41.91
  Bottom 0.203: JP39.2 v148.59,41.91 | SV9.7 181.61,54.48 180.97,55.12 v148.59,55.12
HEPHAESTUS_GPIO  (via drill 0.25)
  Top 0.203: SV9.9 186.69,52.32 187.45,51.56 187.45,4.57 v186.94,4.06 | v130.3,4.06 130.3,36.07 127,39.37 JP32.1
  Bottom 0.203: v186.94,4.06 186.69,3.81 130.56,3.81 v130.3,4.06
HEPHAESTUS_SPD  (via drill 0.25)
  Top 0.203: JP7.1 v95.25,23.88 | v106.68,23.88 v106.68,3.56 | v187.96,3.3 187.96,54.36 187.45,54.86 184.78,54.86 184.15,54.23 SV9.8
  Bottom 0.203: v95.25,23.88 v106.68,23.88 | v106.68,3.56 106.93,3.3 v187.96,3.3
HERA_HALL1  (via drill 0.25)
  Top 0.203: v19.05,76.71 SV12.3 | JP25.1 v90.17,76.71
  Bottom 0.203: v90.17,76.71 v19.05,76.71
HERA_HALL2  (via drill 0.25)
  Top 0.203: SV12.4 v21.59,10.29 | v129.54,10.29 129.54,35.94 128.65,36.83 JP31.1
  Bottom 0.203: v21.59,10.29 v129.54,10.29
HERA_SONAR1  (via drill 0.25)
  Top 0.203: SV11.7 v21.59,86.11 | v129.03,86.11 129.03,52.7 128.4,52.07 JP9.1
  Bottom 0.203: v21.59,86.11 v129.03,86.11
HERA_SONAR2  (via drill 0.25)
  Top 0.203: v39.37,31.75 v39.37,80.77 | v19.05,80.77 SV11.8
  Bottom 0.203: JP3.1 v39.37,31.75 | v39.37,80.77 v19.05,80.77
HERA_SONAR3  (via drill 0.25)
  Top 0.203: SV11.9 v16.51,24.89
  Bottom 0.203: JP17.1 105.41,25.27 105.03,24.89 v16.51,24.89
HERA_SONAR4  (via drill 0.25)
  Top 0.203: JP26.1 v87.63,78.74 | v13.97,78.74 SV11.10
  Bottom 0.203: v87.63,78.74 v13.97,78.74
HERA_SONAR5  (via drill 0.25)
  Top 0.203: v13.97,26.67 SV12.1
  Bottom 0.203: v13.97,26.67 JP4.1
HERA_SONAR6  (via drill 0.25)
  Top 0.203: SV12.2 v16.51,11.62 | v131.06,11.62 131.06,36.32 128.52,38.86 128.52,48.26 127.25,49.53 JP42.2
  Bottom 0.203: v16.51,11.62 v131.06,11.62
HERA_STEER  (via drill 0.25)
  Top 0.203: v24.13,52.07 SV12.5
  Bottom 0.203: JP33.2 v24.13,52.07
HERA_TEMP1  (via drill 0.25)
  Top 0.203: v26.67,49.53 SV12.6
  Bottom 0.203: JP34.2 v26.67,49.53
HERA_TEMP2  (via drill 0.25)
  Top 0.203: v29.21,46.99 SV12.7
  Bottom 0.203: JP35.2 v29.21,46.99
HERA_TEMP3  (via drill 0.25)
  Top 0.203: v31.75,44.45 SV12.8
  Bottom 0.203: JP36.2 v31.75,44.45
HERA_TEMP4  (via drill 0.25)
  Top 0.203: v34.29,36.83 SV12.9
  Bottom 0.203: JP1.1 v34.29,36.83
HERA_TEMP5  (via drill 0.25)
  Top 0.203: v36.83,34.29 SV12.10
  Bottom 0.203: JP2.1 v36.83,34.29
HERMES_AUTOMAN  (via drill 0.25)
  Top 0.203: v125.73,12.95 JP29.1 | SV7.7 60.07,130.81 59.44,130.18 v59.44,12.95
  Bottom 0.203: v59.44,12.95 v125.73,12.95
I2C_SCL  (via drill 0.25)
  Top 0.203: JP27.1 113.03,24.22 R1.1 113.03,24.04 JP53.1 | v24.13,54.61 SV11.6 v24.13,128.27 | v41.91,54.61 v41.91,15.24 | SV15.6 178.94,24.13 178.31,24.77 178.31,42.67 176.53,44.45 176.53,49.78 179.07,52.32 SV9.6 | v109.22,6.86 109.22,17.02 v109.03,17.21 | v157.23,6.1 v157.23,24.13
  Bottom 0.203: SV15.6 178.56,24.13 177.29,25.4 173.99,25.4 172.72,24.13 v157.23,24.13 SV3.6 | v24.13,54.61 v41.91,54.61 | JP53.1 110.62,18.8 v109.03,17.21 107.06,15.24 v41.91,15.24 | v24.13,128.27 SV5.6 50.8,128.27 52.07,127 54.61,127 55.88,128.27 SV7.6 76.2,128.27 77.47,127 80.01,127 81.28,128.27 SV13.6 152.4,128.27 153.67,127 156.21,127 157.48,128.27 SV1.6 | v109.22,6.86 109.73,6.35 156.97,6.35 v157.23,6.1
I2C_SDA  (via drill 0.25)
  Top 0.203: JP28.1 115.57,24.22 R2.1 115.57,24.04 JP54.1 | v26.67,57.15 SV11.5 v26.67,125.73 | v44.45,57.15 v44.45,13.97 | v177.29,27.94 177.29,42.93 176.02,44.2 176.02,51.56 176.53,52.07 SV9.5 | v107.95,6.1 v107.95,14.22 | v159.51,5.33 v159.51,26.67
  Bottom 0.203: SV3.5 v159.51,26.67 172.72,26.67 173.99,27.94 v177.29,27.94 178.56,26.67 SV15.5 | v26.67,57.15 v44.45,57.15 | JP54.1 114.3,17.53 111.25,17.53 v107.95,14.22 107.7,13.97 v44.45,13.97 | v26.67,125.73 SV5.5 50.8,125.73 52.07,124.46 54.61,124.46 55.88,125.73 SV7.5 76.2,125.73 77.47,124.46 80.01,124.46 81.28,125.73 SV13.5 152.4,125.73 153.67,124.46 156.21,124.46 157.48,125.73 SV1.5 | v159.51,5.33 156.72,5.33 156.21,5.84 108.2,5.84 v107.95,6.1
IRIS_UART_RX  (via drill 0.25)
  Top 0.203: v152.15,21.59 v152.15,78.99 | v95.25,78.99 JP24.1
  Bottom 0.203: v152.15,78.99 v95.25,78.99 | v152.15,21.59 SV3.7
IRIS_UART_TX  (via drill 0.25)
  Top 0.203: v97.79,77.72 JP23.1 | v150.88,19.05 v150.88,77.72
  Bottom 0.203: v150.88,77.72 v97.79,77.72 | v150.88,19.05 SV3.8
JANUS_AUTOMAN  (via drill 0.25)
  Top 0.203: SV5.9 44.32,135.89 43.69,135.25 v43.69,62.23
  Bottom 0.203: JP48.2 v43.69,62.23
JANUS_F  (via drill 0.25)
  Top 0.203: SV5.7 46.35,130.81 45.72,130.18 v45.72,64.77
  Bottom 0.203: JP47.2 48.51,64.77 48.01,64.77 v45.72,64.77
JANUS_R  (via drill 0.25)
  Top 0.203: SV5.8 45.34,133.35 44.7,132.72 v44.7,67.31
  Bottom 0.203: JP46.2 v44.7,67.31
JTAG_NRST
  Bottom 0.203: JP69.1 144.65,72.39 J1.10
JTAG_SWO
  Bottom 0.203: J1.6 144.91,68.58 139.7,68.58 JP67.1
JTAG_TDI
  Bottom 0.203: J1.8 138.94,70.36 JP68.1
JTAG_VREF
  Bottom 0.203: JP66.2 146.05,64.77 146.69,65.41 J1.1
LED1_A
  Top 0.406: R3.1 LED1.A
LED1_C
  Top 0.406: LED1.C Q1.3
LED1_G
  Top 0.203: JP55.1 90.17,17.02 89.6,16.44 Q1.1
LED2_A
  Top 0.406: R4.1 LED2.A
LED2_C
  Top 0.406: LED2.C Q2.3
LED2_G
  Top 0.203: JP56.1 92.71,17.02 93.15,16.58 Q2.1
LED3_A
  Top 0.406: R5.1 LED3.A
LED3_C
  Top 0.406: LED3.C Q3.3
LED3_G
  Top 0.203: JP57.1 97.79,17.27 96.71,16.19 Q3.1
LED4_A
  Top 0.406: LED4.A R6.1
LED4_C
  Top 0.406: Q4.3 LED4.C
LED4_G
  Top 0.203: JP58.1 105.41,86.36 105.73,86.68 Q4.1
LED5_A
  Top 0.406: LED5.A R7.1
LED5_C
  Top 0.406: LED5.C Q5.3
LED5_G
  Top 0.203: JP59.1 102.87,86.36 102.17,87.06 Q5.1
LED6_A
  Top 0.406: LED6.A R8.1
LED6_C
  Top 0.406: LED6.C Q6.3
LED6_G
  Top 0.203: JP60.1 100.33,86.36 98.62,88.07 Q6.1
LED7_A
  Top 0.406: R9.1 LED7.A
LED7_C
  Top 0.406: LED7.C Q7.3
LED7_G
  Top 0.203: JP61.1 100.33,16.76 100.26,16.7 Q7.1
LED8_A
  Top 0.406: R10.1 LED8.A
LED8_C
  Top 0.406: LED8.C Q8.3
LED8_G
  Top 0.203: JP62.1 102.87,17.02 103.82,16.07 Q8.1
LED9_A
  Top 0.406: LED9.A R11.1
LED9_C
  Top 0.406: Q9.3 LED9.C
LED9_G
  Top 0.203: JP63.1 133.35,41.4 133.03,41.08 Q9.1
LED10_A
  Top 0.406: LED10.A R12.1
LED10_C
  Top 0.406: Q10.3 LED10.C
LED10_G
  Top 0.203: JP64.1 135.95,46.99 136.59,46.35 Q10.1
LED11_A
  Top 0.406: LED11.A R13.1
LED11_C
  Top 0.406: Q11.3 LED11.C
LED11_G
  Top 0.203: JP65.1 107.95,86.36 109.29,87.7 Q11.1
LED12_A
  Top 0.406: LED12.A R20.1
LED12_C
  Top 0.406: Q12.3 LED12.C
LED12_G
  Top 0.203: Q12.1 95.06,87.25 95.7,86.61 97.16,86.61 97.79,85.98 JP71.1
LED13_R
  Top 0.406: R21.1 LED13.A
LED14_R
  Top 0.406: R22.1 LED14.A
LED15_R
  Top 0.406: R23.1 LED15.A
MCU_BOOT0
  Top 0.203: U1.60 99.85,68.45 99.22,69.09 93.34,69.09 92.71,69.72 92.71,78.65 R15.1 R17.2
MCU_BOOT1
  Top 0.203: JP19.1 110.49,20.95 111.25,20.19 111.25,13.72 112.27,12.7 R16.1 R18.2
MCU_NRST  (via drill 0.25)
  Top 0.203: JP69.2 135.89,83.33 S1.2 S1.1 | U1.7 82.93,51.55 82.3,52.19 82.3,54.62 81.66,55.26 C8.1 81.03,55.24 80.39,54.61 R14.1 78.74,55.21 v78.74,58.67 | v78.74,60.71 v78.74,73.66
  Bottom 0.203: JP69.2 123.44,72.39 122.17,73.66 v78.74,73.66 | v78.74,58.67 v78.74,60.71
MCU_PA0
  Top 0.203: JP1.2 83.69,36.83 84.33,37.47 84.33,44.58 84.96,45.21 93.09,45.21 93.73,45.85 93.73,47.41 94.36,48.05 U1.14
MCU_PA1
  Top 0.203: JP2.2 84.2,34.29 84.84,34.92 84.84,44.07 85.47,44.7 93.6,44.7 94.23,45.34 94.23,46.91 94.87,47.55 U1.15
MCU_PA2
  Top 0.203: JP3.2 84.71,31.75 85.34,32.38 85.34,43.56 85.98,44.2 94.11,44.2 94.74,44.83 94.74,46.41 95.38,47.05 U1.16
MCU_PA3
  Top 0.203: JP4.2 87,29.21 87.63,29.84 87.63,32.89 88.27,33.53 96.65,33.53 97.28,34.16 97.28,44.2 97.85,44.76 U1.17
MCU_PA4
  Top 0.203: U1.20 99.35,33.66 98.72,33.02 90.81,33.02 90.17,32.38 JP5.2
MCU_PA5
  Top 0.203: U1.21 99.85,33.15 99.22,32.51 93.34,32.51 92.71,31.88 JP6.2
MCU_PA6
  Top 0.203: U1.22 100.35,32.64 99.72,32 95.89,32 95.25,31.37 JP7.2
MCU_PA7
  Top 0.203: U1.23 100.85,32.13 100.22,31.5 98.42,31.5 97.79,30.86 JP8.2
MCU_PA8
  Top 0.203: U1.41 120.65,51.05 121.67,52.07 JP9.2
MCU_PA9
  Top 0.203: U1.42 120.27,51.55 120.9,52.19 120.9,53.85 121.67,54.61 JP10.2
MCU_PA10
  Top 0.203: U1.43 119.76,52.05 120.4,52.69 120.4,56.39 121.16,57.15 JP11.2
MCU_PA11
  Top 0.203: U1.44 119.25,52.55 119.89,53.19 119.89,59.05 120.52,59.69 JP12.2
MCU_PA12
  Top 0.203: U1.45 118.75,53.05 119.38,53.69 119.38,61.59 120.02,62.23 JP13.2
MCU_PA13
  Top 0.203: U1.46 118.24,53.55 118.87,54.19 118.87,64.14 119.51,64.77 JP14.2
MCU_PA14
  Top 0.203: U1.49 105.35,66.42 105.98,67.06 120.02,67.06 120.65,67.69 JP15.2
MCU_PA15
  Top 0.203: U1.50 104.85,66.93 105.48,67.56 117.47,67.56 118.11,68.2 JP16.2
MCU_PB0
  Top 0.203: U1.26 102.35,32.13 102.98,31.5 104.78,31.5 105.41,30.86 JP17.2
MCU_PB1
  Top 0.203: U1.27 102.85,32.64 103.48,32 107.31,32 107.95,31.37 JP18.2
MCU_PB2
  Top 0.203: U1.28 103.35,33.15 103.98,32.51 109.86,32.51 110.49,31.88 JP19.2
MCU_PB3
  Top 0.203: U1.55 102.35,69.47 102.98,70.1 104.78,70.1 105.41,70.74 JP20.2
MCU_PB4
  Top 0.203: U1.56 101.85,69.85 102.87,70.87 JP21.2
MCU_PB5
  Top 0.203: U1.57 101.35,69.85 100.33,70.87 JP22.2
MCU_PB6
  Top 0.203: U1.58 100.85,69.47 100.22,70.1 98.42,70.1 97.79,70.74 JP23.2
MCU_PB7
  Top 0.203: U1.59 100.35,68.96 99.72,69.6 95.89,69.6 95.25,70.23 JP24.2
MCU_PB8
  Top 0.203: U1.61 99.35,67.94 98.72,68.58 90.81,68.58 90.17,69.22 JP25.2
MCU_PB9
  Top 0.203: U1.62 98.85,67.44 98.22,68.07 88.27,68.07 87.63,68.71 JP26.2
MCU_PB10
  Top 0.203: U1.29 103.85,33.66 104.48,33.02 112.39,33.02 113.03,32.38 JP27.2
MCU_PB11
  Top 0.203: U1.30 104.35,34.16 104.98,33.53 114.94,33.53 115.57,32.89 JP28.2
MCU_PB12
  Top 0.203: U1.33 117.22,47.05 117.86,46.41 117.86,32.38 118.49,31.75 JP29.2
MCU_PB13
  Top 0.203: U1.34 117.73,47.55 118.36,46.91 118.36,34.92 119,34.29 JP30.2
MCU_PB14
  Top 0.203: U1.35 118.24,48.05 118.87,47.41 118.87,37.47 119.51,36.83 JP31.2
MCU_PB15
  Top 0.203: U1.36 118.75,48.55 119.38,47.91 119.38,40.01 120.02,39.37 JP32.2
MCU_PC0
  Top 0.203: U1.8 82.55,51.05 81.53,52.07 JP33.1
MCU_PC1
  Top 0.203: U1.9 82.55,50.55 81.53,49.53 JP34.1
MCU_PC2
  Top 0.203: U1.10 82.93,50.05 82.3,49.41 82.3,47.62 81.66,46.99 JP35.1
MCU_PC3
  Top 0.203: U1.11 83.44,49.55 82.8,48.91 82.8,45.09 82.17,44.45 JP36.1
MCU_PC4
  Top 0.203: JP37.1 100.33,30.73 101.35,31.75 U1.24
MCU_PC5
  Top 0.203: JP38.1 102.87,30.73 101.85,31.75 U1.25
MCU_PC6
  Top 0.203: U1.37 119.25,49.05 119.89,48.41 119.89,42.55 120.52,41.91 JP39.1
MCU_PC7
  Top 0.203: U1.38 119.76,49.55 120.4,48.91 120.4,45.09 121.03,44.45 JP40.1
MCU_PC8
  Top 0.203: U1.39 120.27,50.05 120.9,49.41 120.9,47.62 121.54,46.99 JP41.1
MCU_PC9
  Top 0.203: U1.40 120.65,50.55 121.67,49.53 JP42.1
MCU_PC10
  Top 0.203: U1.51 104.35,67.44 104.98,68.07 114.94,68.07 115.57,68.71 JP43.1
MCU_PC11
  Top 0.203: U1.52 103.85,67.94 104.48,68.58 112.39,68.58 113.03,69.22 JP44.1
MCU_PC12
  Top 0.203: U1.53 103.35,68.45 103.98,69.09 109.86,69.09 110.49,69.72 JP45.1
MCU_PC13
  Top 0.203: U1.2 85.47,54.05 84.84,54.69 84.84,66.67 84.2,67.31 JP46.1
MCU_PC14
  Top 0.203: U1.3 84.96,53.55 84.33,54.19 84.33,64.14 83.69,64.77 JP47.1
MCU_PC15
  Top 0.203: U1.4 84.45,53.05 83.82,53.69 83.82,61.59 83.19,62.23 JP48.1
MCU_PD2
  Top 0.203: U1.54 102.85,68.96 103.48,69.6 107.31,69.6 107.95,70.23 JP49.1
MCU_PH0
  Top 0.203: U1.5 83.95,52.55 83.31,53.19 83.31,59.05 82.68,59.69 74.06,59.69 QG1.3
MCU_PH1
  Top 0.203: JP70.1 82.17,57.15 82.8,56.52 82.8,52.69 83.44,52.05 U1.6
MCU_VCAP_1
  Top 0.203: U1.31 104.85,43.12 C21.1
MCU_VCAP_2
  Top 0.203: U1.47 109.28,54.05 C20.1
OLYMPUS_GPIO1
  Top 0.203: JP5.1 JP55.2
OLYMPUS_GPIO2
  Top 0.203: JP6.1 JP56.2
OLYMPUS_GPIO3
  Top 0.203: JP57.2 JP8.1
OLYMPUS_GPIO4  (via drill 0.25)
  Top 0.203: JP20.1 JP58.2 | v132.59,83.06 132.59,70.61 JP67.2
  Bottom 0.203: v132.59,83.06 106.68,83.06 JP58.2
OLYMPUS_GPIO5
  Top 0.203: JP21.1 JP59.2
OLYMPUS_GPIO6
  Top 0.203: JP22.1 JP60.2
OLYMPUS_GPIO7
  Top 0.203: JP61.2 JP37.2
OLYMPUS_GPIO8
  Top 0.203: JP62.2 JP38.2
OLYMPUS_GPIO9
  Bottom 0.203: JP63.2 JP40.2
OLYMPUS_GPIO10
  Bottom 0.203: JP41.2 JP64.2
OLYMPUS_GPIO11
  Top 0.203: JP49.2 JP65.2
OLYMPUS_GPIO12  (via drill 0.25)
  Top 0.203: JP70.2 71.5,57.15 70.87,57.78 v70.87,81.79
  Bottom 0.203: v70.87,81.79 JP71.2
OLYMPUS_SWDCLK  (via drill 0.25)
  Top 0.203: J1.4 144.15,67.82 143.51,68.45 v143.51,74.93
  Bottom 0.203: JP15.1 v143.51,74.93
OLYMPUS_SWDIO
  Bottom 0.203: JP14.1 127,66.04 139.7,66.04 140.21,66.55 J1.2
OLYMPUS_USBDN  (via drill 0.25)
  Top 0.406: X1.2 138.39,59.65 v138.43,59.69
  Bottom 0.406: v138.43,59.69 JP12.1
OLYMPUS_USBDP  (via drill 0.25)
  Top 0.406: X1.3 v139.19,62.23
  Bottom 0.406: v139.19,62.23 JP13.1
OLYMPUS_USBID  (via drill 0.25)
  Top 0.406: X1.4 139.99,57.11 v139.95,57.15
  Bottom 0.406: v139.95,57.15 JP11.1
OSC_EN
  Top 0.203: QG1.1 66.58,55.5 R19.1
PP3V3  (via drill 0.25, 0.6)
  Top 0.203: 107.76,44.65 107.7,44.59 | 105.52,44.59 105.35,44.76 U1.32 | U1.48 107.64,54.55 | U1.19 98.85,43.11 C1.1 | v195.71,120.65 195.77,120.59 | U1.64 97.85,56.84 97.54,57.15 97.03,57.15 | v96.52,45.72 96.52,45.97 | v89.92,45.97 90.17,45.72 L1.2 | JP66.1 134.49,64.77 133.86,65.41 v133.86,67.06 | R16.2 117.22,12.7 117.86,13.34 117.86,22.23 117.22,22.86 v117.09,22.86 | QG1.4 67.06,59.3 66.42,58.67 R19.2 65.24,57.37 64.52,56.64 64.52,54.23 65.15,53.59 75.69,53.59 76.71,54.61 R14.2 | C9.1 68.69,80.38 v68.83,80.52 | R15.2 89.79,78.99 89.15,79.63 v89.15,80.52 v89.15,112.78
  Top 0.406: C2.1 106.28,44.45 105.41,44.45 | JP52.1 126.49,98.26 127.13,98.89 R21.2
  Top 0.61: C2.1 107.7,44.59 108,44.59 C5.1 | 108.2,46.23 116.46,46.23 117.09,45.59 117.09,24.22 R2.2 arc90 117.09,24.04 v117.09,22.86 | R1.2 arc-90 111.51,24.04 v111.51,22.86 | QG1.4 68.69,59.43 C9.1
  Top 1.27: v123.7,68.83 120.9,66.04 107.06,66.04 106.43,65.41 106.43,56.64
  Top 1.93: SV7.3 66.17,120.65 65.53,120.02 v65.53,112.78 | v65.53,112.78 v64.26,112.78 | v65.53,112.78 v66.8,112.78 | SV13.3 142.37,120.65 141.73,120.02 v141.73,112.78 | v141.73,112.78 v140.46,112.78 | v141.73,112.78 v143,112.78 | SV11.3 v31.75,112.78 v33.02,112.78 v33.02,120.65 v34.29,120.65 | v125.22,112.78 v126.49,112.78 | v127.76,112.78 v126.49,112.78 | SV1.3 v198.25,120.65 v196.98,120.65 195.83,120.65 195.77,120.59 195.2,120.02 v195.2,50.55 v193.93,50.55 | SV9.3 v171.45,50.55 v173.99,50.55 | SV3.3 159.38,31.75 160.02,32.38 v160.02,50.55 | v160.02,50.55 v158.75,50.55 | v160.02,50.55 v161.29,50.55 | SV15.3 184.78,31.75 185.42,32.38 v185.42,50.55 v184.15,50.55 v182.88,50.55 | v123.7,68.83 123.7,97.16 124.33,97.79 JP52.1 v126.49,112.78
  Bottom 0.203: v89.92,45.97 90.17,45.72 v96.52,45.72 | v133.86,67.06 124.33,67.06 123.7,67.69 v123.7,68.83 | v89.15,80.52 v68.83,80.52
  Bottom 0.61: v111.51,22.86 v117.09,22.86
  Bottom 1.93: v31.75,111.51 v31.75,112.78 v64.26,112.78 | SV5.3 v33.02,120.65 | v64.26,112.78 v66.8,112.78 | v64.26,112.78 v89.15,112.78 v125.22,112.78 v127.76,112.78 v140.46,112.78 195.2,112.78 195.2,120.02 195.83,120.65 SV1.3 | v158.75,50.55 v171.45,50.55 v172.72,50.55 v173.99,50.55 v182.88,50.55 v195.2,50.55 v195.2,51.82
  pour Top (isolate 0.254, rank 3): 95.76,57.4 95.76,44.2 109.22,44.2 109.22,57.4
PP3V3A
  Top 0.203: U1.13 92.89,48.55 C6.1
  Top 0.305: L1.1 92.8,46.04 C7.1
  Top 0.61: C6.1 92.6,46.94 C7.1
PP5V  (via drill 0.25, 0.6)
  Top 0.203: v198.25,118.11 198.18,118.05 198.18,117.92
  Top 0.406: JP51.1 131.57,98.26 132.21,98.89 R22.2
  Top 0.61: R3.2 R4.2 R5.2 R9.2 R10.2 v102.87,2.54 | R7.2 R8.2 R20.2 | R7.2 104.27,97.88 104.9,98.51 | 105.54,97.88 104.9,98.51 | R7.2 R6.2 R13.2 | 104.9,98.51 v104.9,110.24 | SV3.2 153.8,34.29 153.16,33.66 v153.16,2.03 | v129.29,2.54 130.68,2.54 132.08,3.94 R11.2 R12.2
  Top 1.93: SV7.2 70.23,118.11 69.6,117.47 v69.6,110.24 | v69.6,110.24 v68.33,110.24 | v69.6,110.24 v70.87,110.24 | SV13.2 146.43,118.11 145.8,117.47 v145.8,110.24 | v145.8,110.24 v144.53,110.24 | v145.8,110.24 v147.07,110.24 | SV11.2 v34.29,110.24 v35.56,110.24 v35.56,118.11 v36.83,118.11 | JP51.1 v131.57,110.24 | v131.57,110.24 v130.3,110.24 | v131.57,110.24 v132.84,110.24 | SV1.2 198.37,118.11 198.18,117.92 197.74,117.47 v197.74,116.84 v197.74,115.57 v197.74,48.01 v196.47,48.01 | v171.45,48.01 v168.91,48.01 SV9.2 | v154.94,48.01 v157.48,48.01 157.48,34.92 156.84,34.29 SV3.2 | SV15.2 182.25,34.29 182.88,34.92 v182.88,48.01 v181.61,48.01 v180.34,48.01
  Bottom 0.61: v102.87,2.54 v129.29,2.54 152.65,2.54 v153.16,2.03
  Bottom 1.93: v34.29,108.97 v34.29,110.24 v70.87,110.24 v104.9,110.24 v132.84,110.24 v144.53,110.24 197.74,110.24 197.74,117.47 198.37,118.11 SV1.2 | SV5.2 v35.56,118.11 | v154.94,48.01 v156.21,48.01 v157.48,48.01 v168.91,48.01 v170.18,48.01 v171.45,48.01 v180.34,48.01 v197.74,48.01 v197.74,49.28
PP12V  (via drill 0.6)
  Top 0.406: JP50.1 136.65,98.26 137.29,98.89 R23.2
  Top 1.93: SV9.1 v166.37,45.47 | v177.8,45.47 v180.34,45.47 SV15.1 | v199.01,45.47 v200.28,45.47 v200.28,107.7 v200.28,108.97 v200.28,110.24 200.28,115.19 SV1.1 | SV11.1 v36.83,107.7 v38.1,107.7 38.35,107.95 v38.35,115.57 v39.62,115.57 | JP50.1 v136.65,107.7 | v136.65,107.7 v137.92,107.7 | v136.65,107.7 v135.38,107.7 | SV7.1 v73.66,107.7 | v73.66,107.7 v72.39,107.7 | v73.66,107.7 v74.93,107.7 | SV13.1 v149.86,107.7 | v149.86,107.7 v148.59,107.7 | v149.86,107.7 v151.13,107.7 | SV3.1 v154.94,44.2 v154.94,45.47 | v166.37,45.47 v165.1,45.47 | v166.37,45.47 v167.64,45.47
  Bottom 1.93: v200.28,46.74 v200.28,45.47 v180.34,45.47 v179.07,45.47 v177.8,45.47 v165.1,45.47 v154.94,45.47 v154.94,42.93 | v36.83,106.43 v36.83,107.7 v72.39,107.7 v137.92,107.7 v148.59,107.7 v200.28,107.7 200.28,115.19 SV1.1 | SV5.1 v38.35,115.57
ZEUS_GPIO  (via drill 0.25)
  Top 0.203: JP44.2 113.03,78.99 v114.3,80.26 | SV1.8 188.59,133.35 187.96,132.72 v187.96,80.26
  Bottom 0.203: v114.3,80.26 v187.96,80.26
ZEUS_SHUTDOWN_N  (via drill 0.25)
  Top 0.203: SV1.7 191.13,130.81 190.5,130.18 v190.5,57.15
  Bottom 0.203: v190.5,57.15 148.84,57.15 146.3,54.61 JP10.1

## Text on the board
tPlace: JANUS | HERMES | APOLLO | ZEUS | DO NOT BRIDGE | Justin Ng / IGVC Olympus v1.0 / Cal Poly, SLO / October 24, 2015 | PP3V3 / GND | PP5V / GND | PP12V / GND | RESET | JTAG | HEPHAESTUS | OLYMPUS | HERA | IRIS | DIONYSUS | Thanks to / Bay Area Circuits!
tNames: BOOT0 | H / L | PB09 | PB08 | PB07 | PB06 | PB05 | PB04 | PB03 | PD02 | PC12 | PC11 | PC10 | PA15 | PA14 | PC13 | PC14 | PA13 | PC15 | PA12 | PH00 | PA11 | PH01 | PA10 | NRST | PA09 | PC00 | PA08 | PC01 | PC09 | PC02 | PC08 | PC03 | PC07 | PC06 | PB15 | PA00 | PB14 | PA01 | PB13 | PA02 | PB12 | PA04 | PA05 | PA06 | PA07 | PC04 | PC05 | PB00 | PB01 | PB02 | PB10 | PB11 | PA03 | H / L | BOOT1